# EAGLE design bluetooth_version (EAGLE 9.6.2)
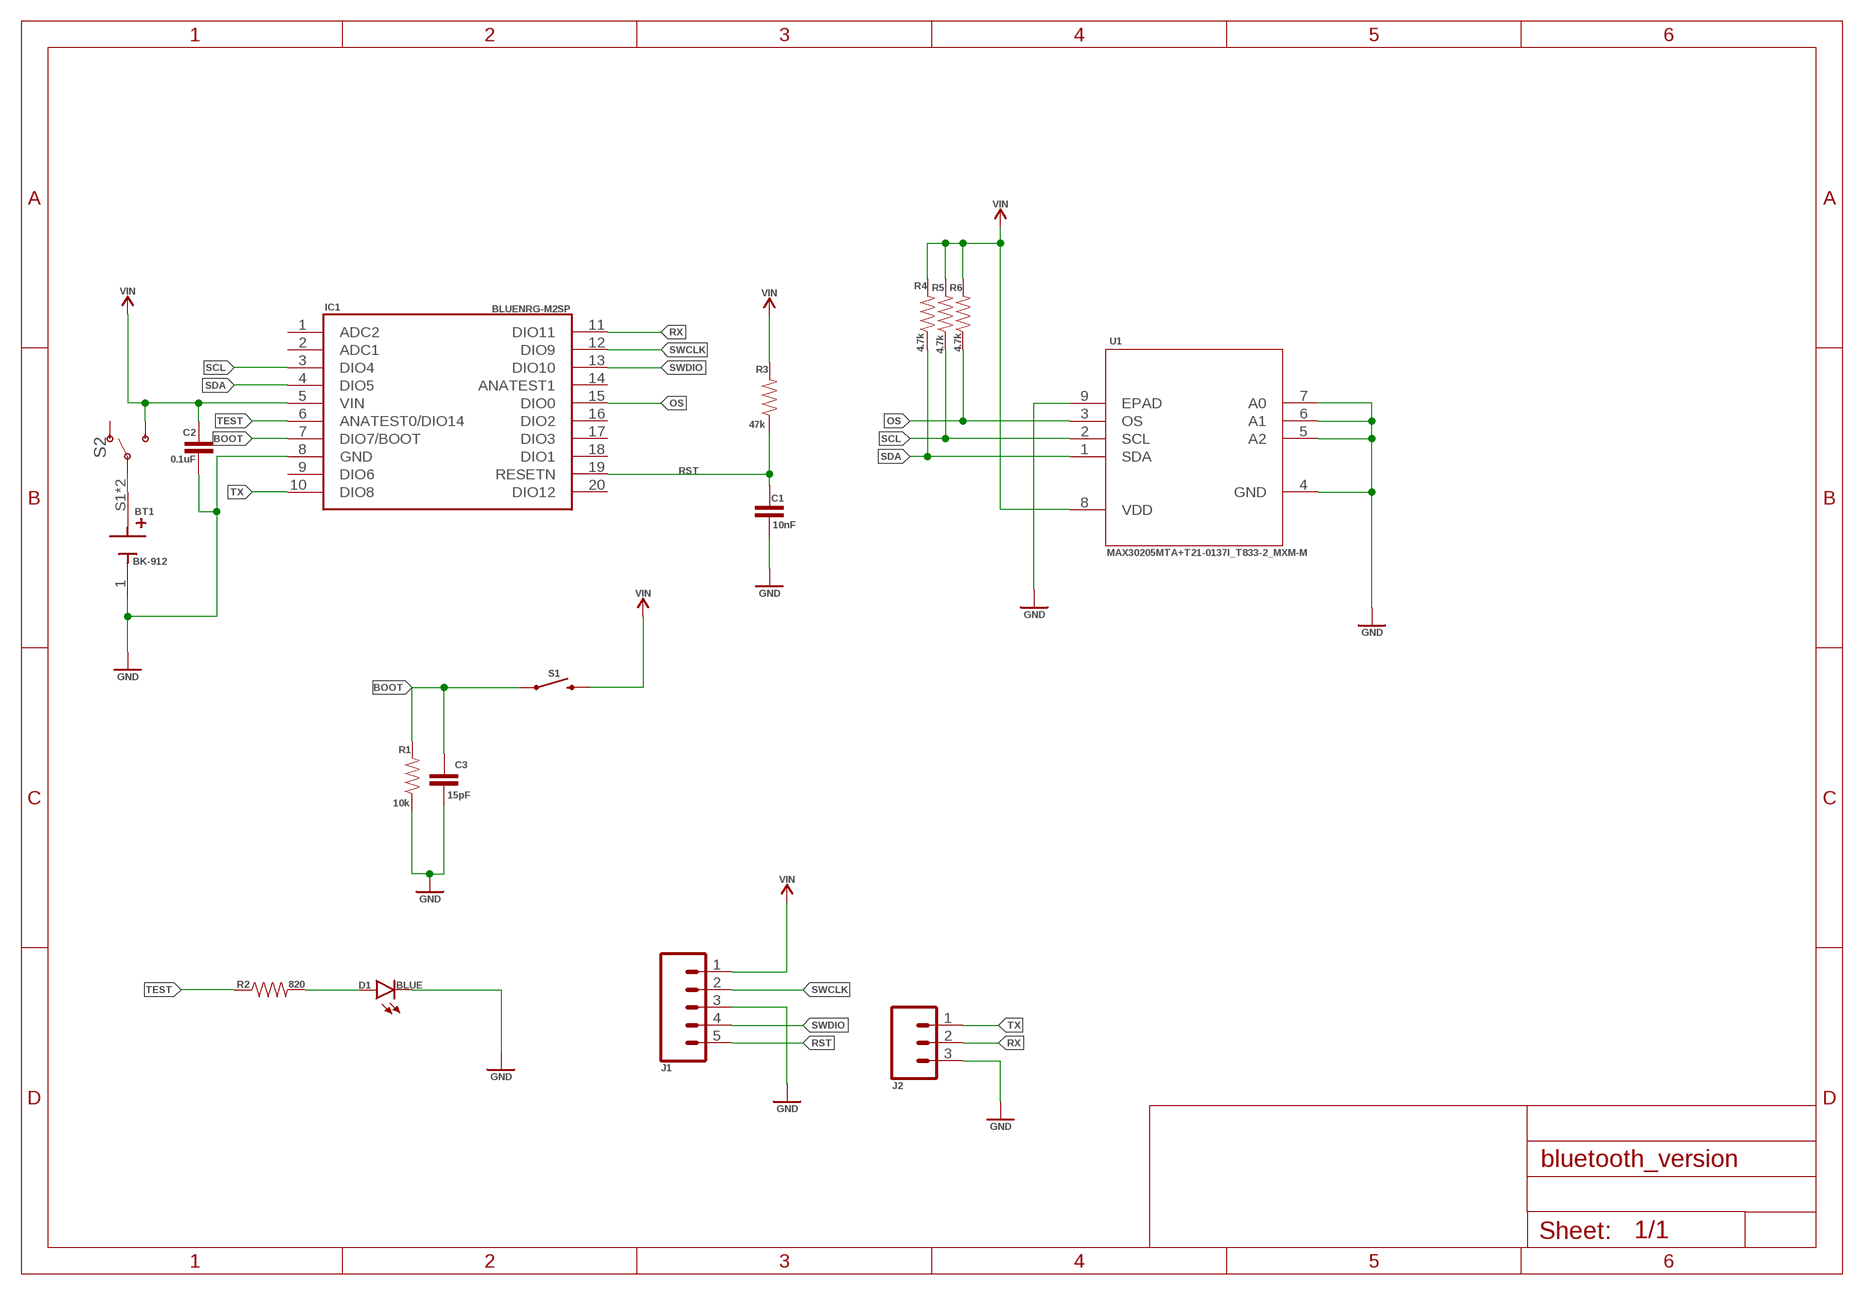
[diagram p0: schematic, sheet 1]

## Parts
BT1  BK-912  [BAT_BK-912]
C1  10nF  10NF-0603-50V-10%  [0603]
C2  0.1uF  0.1UF-0603-25V-(+80/-20%)  [0603]
C3  15pF  15PF-0603-50V-5%  [0603]
D1  BLUE  LED-BLUE0603  [LED-0603]
IC1  BLUENRG-M2SP  [BLUENRGM2SP]
J1  CONN_05  [1X05]
J2  455-1750-1-ND  CONN_03  [1X03]
R1  10k  10KOHM-0603-1/10W-1%  [0603]
R2  820  8.2KOHM-0603-1/10W-5%  [0603]
R3  47k  47KOHM-0603-1/10W-1%  [0603]
R4  4.7k  4.7KOHM-0603-1/10W-1%  [0603]
R5  4.7k  4.7KOHM-0603-1/10W-1%  [0603]
R6  4.7k  4.7KOHM-0603-1/10W-1%  [0603]
S1  MOMENTARY-SWITCH-SPST-SMD-4.6X2.8MM  [TACTILE_SWITCH_SMD_4.6X2.8MM]
S2  SWITCH-SPDT-SMD-RIGHT-ANGLE  [SWITCH_SPST_SMD_A]
U1  MAX30205MTA+T21-0137I_T833-2_MXM-M  [21-0137I_T833-2_MXM-M]

## Nets
BOOT: C3.1 IC1.7(DIO7/BOOT) R1.2 S1.1 S1.2
GND: BT1.1(-) C1.2 C2.2 C3.2 D1.C IC1.8(GND) J1.3 J2.3 R1.1 U1.4(GND) U1.5(A2) U1.6(A1) U1.7(A0) U1.9(EPAD)
N$1: D1.A R2.2
N$2: BT1.S1(+) BT1.S2(+) S2.2(P)
OS: IC1.15(DIO0) R6.1 U1.3(OS)
RST: C1.1 IC1.19(RESETN) J1.5 R3.1
RX: IC1.11(DIO11) J2.2
SCL: IC1.3(DIO4) R5.1 U1.2(SCL)
SDA: IC1.4(DIO5) R4.1 U1.1(SDA)
SWCLK: IC1.12(DIO9) J1.2
SWDIO: IC1.13(DIO10) J1.4
TEST: IC1.6(ANATEST0/DIO14) R2.1
TX: IC1.10(DIO8) J2.1
VIN: C2.1 IC1.5(VIN) J1.1 R3.2 R4.2 R5.2 R6.2 S1.3 S1.4 S2.3(S) U1.8(VDD)
Unconnected: IC1.1(ADC2) IC1.2(ADC1) IC1.9(DIO6) IC1.14(ANATEST1) IC1.16(DIO2) IC1.17(DIO3) IC1.18(DIO1) IC1.20(DIO12) S2.1(O)

## Library data of the parts
BT1 = BK-912:BK-912: BATTERY RETAINER COIN PC PIN Check prices <https://pricing.snapeda.com/search/part/BK-912/?ref=eda>; AVAILABILITY: Warning; DESCRIPTION: Battery Retainer Coin, 20.0mm 1 Cell SMD (SMT) Tab; MF: MPD (Memory; MP: BK-912; PACKAGE: DFN-12 Memory Protection Devices; PRICE: None; PURCHASE-URL: https://pricing.snapeda.com/search/part/BK-912/?ref=eda
C1 = SparkFun-Capacitors:10NF: 0.01uF/10nF/10,000pF ceramic capacitors A capacitor is a passive two-terminal electrical component used to store electrical energy temporarily in an electric field. CAP-09321; PROD_ID: CAP-00867
C2 = SparkFun-Capacitors:0.1UF: 0.1µF ceramic capacitors A capacitor is a passive two-terminal electrical component used to store electrical energy temporarily in an electric field.; PROD_ID: CAP-00810
C3 = SparkFun-Capacitors:15PF: 15pF ceramic capacitors A capacitor is a passive two-terminal electrical component used to store electrical energy temporarily in an electric field.; PROD_ID: CAP-07881
D1 = SparkFun-LED:LED-BLUE: Blue SMD LED Used in manufacturing of various products at SparkFun Packages: 0603 - SMD 0603 package [Product Link] <http://www.digikey.com/product-detail/en/SMLE12BC7TT86/511-1589-2-ND/1641808> 1206 - SMD1206 package [Product Link] <http://www.digikey.com/product-detail/en/lite-on-inc/LTST-C150TBKT/160-1643-1-ND/573584> SparkFun Products: ESP8266 Thing-Dev Board <https://www.sparkfun.com/products/13711> RedBoard <https://www.sparkfun.com/products/12757>; PROD_ID: DIO-08575
IC1 = SamacSys_Parts:BLUENRG-M2SP: STMicroelectronics Source: Datasheet <https://www.st.com/resource/en/datasheet/bluenrg-m2.pdf>; ARROW_PART_NUMBER: BLUENRG-M2SP; ARROW_PRICE-STOCK: https://www.arrow.com/en/products/bluenrg-m2sp/stmicroelectronics; DESCRIPTION: STMicroelectronics; HEIGHT: 2.5mm; MANUFACTURER_NAME: STMicroelectronics; MANUFACTURER_PART_NUMBER: BLUENRG-M2SP; MOUSER_PART_NUMBER: 511-BLUENRG-M2SP; MOUSER_PRICE-STOCK: https://www.mouser.co.uk/ProductDetail/STMicroelectronics/BLUENRG-M2SP?qs=%252B6g0mu59x7IAMQd6TX9bOA%3D%3D
J1 = SparkFun-Connectors:CONN_05: Multi connection point. Often used as Generic Header-pin footprint for 0.1 inch spaced/style header connections On any of the 0.1 inch spaced packages, you can populate with these: Break Away Headers - Straight <https://www.sparkfun.com/products/116> (PRT-00116) Break Away Male Headers - Right Angle <https://www.sparkfun.com/products/553> (PRT-00553) Female Headers <https://www.sparkfun.com/products/115> (PRT-00115) Break Away Headers - Machine Pin <https://www.sparkfun.com/products/117> (PRT-00117) Break Away Female Headers - Swiss Machine Pin <https://www.sparkfun.com/products/743> (PRT-00743) For SCREWTERMINALS and SPRING TERMINALS visit here: Screw Terimnals on SparkFun.com <https://www.sparkfun.com/search/results?term=Screw+Terminals> (5mm/3.5mm/2.54mm spacing) This device is also useful as a general connection point to wire up your design to another part of your project. Our various solder wires solder well into these plated through hole pads. Hook-Up Wire - Assortment (Stranded, 22 AWG) <https://www.sparkfun.com/products/11375> (PRT-11375) Hook-Up Wire - Assortment (Solid Core, 22 AWG) <https://www.sparkfun.com/products/11367> (PRT-11367) View the entire wire category on our website here <https://www.sparkfun.com/categories/141> Special notes: Molex polarized connector foot print use with SKU : PRT-08231 with associated crimp pins and housings. 1MM SMD Version SKU: PRT-10208
J2 = SparkFun-Connectors:CONN_03: Multi connection point. Often used as Generic Header-pin footprint for 0.1 inch spaced/style header connections On any of the 0.1 inch spaced packages, you can populate with these: Break Away Headers - Straight <https://www.sparkfun.com/products/116> (PRT-00116) Break Away Male Headers - Right Angle <https://www.sparkfun.com/products/553> (PRT-00553) Female Headers <https://www.sparkfun.com/products/115> (PRT-00115) Break Away Headers - Machine Pin <https://www.sparkfun.com/products/117> (PRT-00117) Break Away Female Headers - Swiss Machine Pin <https://www.sparkfun.com/products/743> (PRT-00743) Stackable Header - 3 Pin (Female, 0.1") <https://www.sparkfun.com/products/13875> (PRT-13875) For SCREWTERMINALS and SPRING TERMINALS visit here: Screw Terimnals on SparkFun.com <https://www.sparkfun.com/search/results?term=Screw+Terminals> (5mm/3.5mm/2.54mm spacing) This device is also useful as a general connection point to wire up your design to another part of your project. Our various solder wires solder well into these plated through hole pads. Hook-Up Wire - Assortment (Stranded, 22 AWG) <https://www.sparkfun.com/products/11375> (PRT-11375) Hook-Up Wire - Assortment (Solid Core, 22 AWG) <https://www.sparkfun.com/products/11367> (PRT-11367) View the entire wire category on our website here <https://www.sparkfun.com/categories/141> Special notes: Molex polarized connector foot print use with SKU : PRT-08232 with associated crimp pins and housings.; PROD_ID: XXX-00000
R1 = SparkFun-Resistors:10KOHM: 10kΩ resistor A resistor is a passive two-terminal electrical component that implements electrical resistance as a circuit element. Resistors act to reduce current flow, and, at the same time, act to lower voltage levels within circuits. - Wikipedia; PROD_ID: RES-00824
R2 = SparkFun-Resistors:8.2KOHM: 8.2kΩ resistor A resistor is a passive two-terminal electrical component that implements electrical resistance as a circuit element. Resistors act to reduce current flow, and, at the same time, act to lower voltage levels within circuits. - Wikipedia; PROD_ID: RES-10646; SPICEPREFIX: R; VALUE: 8.2k
R3 = SparkFun-Resistors:47KOHM: 47kΩ resistor A resistor is a passive two-terminal electrical component that implements electrical resistance as a circuit element. Resistors act to reduce current flow, and, at the same time, act to lower voltage levels within circuits. - Wikipedia; PROD_ID: RES-07871
R4-R6 = SparkFun-Resistors:4.7KOHM: 4.7kΩ resistor A resistor is a passive two-terminal electrical component that implements electrical resistance as a circuit element. Resistors act to reduce current flow, and, at the same time, act to lower voltage levels within circuits. - Wikipedia; PROD_ID: RES-07857
S1 = SparkFun-Switches:MOMENTARY-SWITCH-SPST: Momentary Switch (Pushbutton) - SPST Normally-open (NO) SPST momentary switches (buttons, pushbuttons). Variants PTH-12MM - 12mm square, through-hole Momentary Pushbutton Switch - 12mm Square <https://www.sparkfun.com/products/9190> (COM-09190) PTH-6.0MM, PTH-6.0MM-KIT - 6.0mm square, through-hole Mini Pushbutton Switch <https://www.sparkfun.com/products/97> (COM-00097) KIT package intended for soldering kit's - only one side of pads' copper is exposed. PTH-RIGHT-ANGLE-KIT - Right-angle, through-hole Right Angle Tactile Button <https://www.sparkfun.com/products/10791> - Used on SparkFun BigTime Watch Kit <https://www.sparkfun.com/products/11734> SMD-12MM - 12mm square, surface-mount Tactile Button - SMD (12mm) <https://www.sparkfun.com/products/12993> (COM-12993) Used on SparkFun PicoBoard <https://www.sparkfun.com/products/11888> SMD-4.5MM - 4.5mm Square Trackball Switch Used on SparkFun Blackberry Trackballer Breakout <https://www.sparkfun.com/products/13169> SMD-4.6MMX2.8MM - 4.60mm x 2.80mm, surface mount Used on SparkFun SAMD21 Mini Breakout <https://www.sparkfun.com/products/13664> SMD-5.2MM, SMD-5.2-REDUNDANT - 5.2mm square, surface-mount Mini Pushbutton Switch - SMD <https://www.sparkfun.com/products/8720> (COM-08720) Used on Arduino Pro Mini <https://www.sparkfun.com/products/11114> REDUNDANT package connects both switch circuits together SMD-6.0X3.5MM - 6.0 x 3.5mm, surface mount Momentary Reset Switch SMD <https://www.sparkfun.com/products/8229> (COM-08229) SMD-6.2MM-TALL - 6.2mm square, surface mount Tactile Button - SMD (6mm) <https://www.sparkfun.com/products/12992> Used on SparkFun Digital Sandbox <https://www.sparkfun.com/products/12651> SMD-RIGHT-ANGLE - Right-angle, surface mount Used on SparkFun Block for Intel® Edison - Arduino <https://www.sparkfun.com/products/13036>; PROD_ID: SWCH-13065
S2 = SparkFun-Switches:SWITCH-SPDT: Single Pole, Double Throw (SPDT) Switch Single-pole, double-throw (SPDT) switch. Variant Overview SMD-AYZ0202 Surface Mount DPDT Switch <https://www.sparkfun.com/products/597> (COM-00597) Used on e.g. LilyPad Arduino USB - ATmega32U4 Board <https://www.sparkfun.com/products/12049> PTH-11.6X4.0MM SPDT Mini Power Switch <https://www.sparkfun.com/products/102> (COM-00102) Used on e.g. SparkFun Simon Says - Through-Hole Soldering Kit <https://www.sparkfun.com/products/10547> (KIT-10547) PTH-11.6X4.0MM-KIT KIT version of SPDT Mini Power Switch - Simplifies soldering by removing tStop of switch pins - only one side can be soldered. PTH-11.6X4.0MM-LOCK LOCK version of SPDT Mini Power Switch - Offset pins hold switch in place for easier soldering. SMD-RIGHT-ANGLE Surface Mount Right Angle Switch <https://www.sparkfun.com/products/10860> (COM-10860) Used on e.g. SparkFun ESP8266 Thing <https://www.sparkfun.com/products/13231>; PROD_ID: SWCH-10651; SF_SKU: COM-10860
U1 = MAX30205:MAX30205MTA+T; BUILT_BY: EMA_UL_Team; COPYRIGHT: Copyright (C) 2018 Accelerated Designs. All rights reserved; MANUFACTURER_PART_NUMBER: MAX30205MTA+T; SOURCELIBRARY: Maxim_2018-11-30; VENDOR: Maxim Integrated Products

## Board
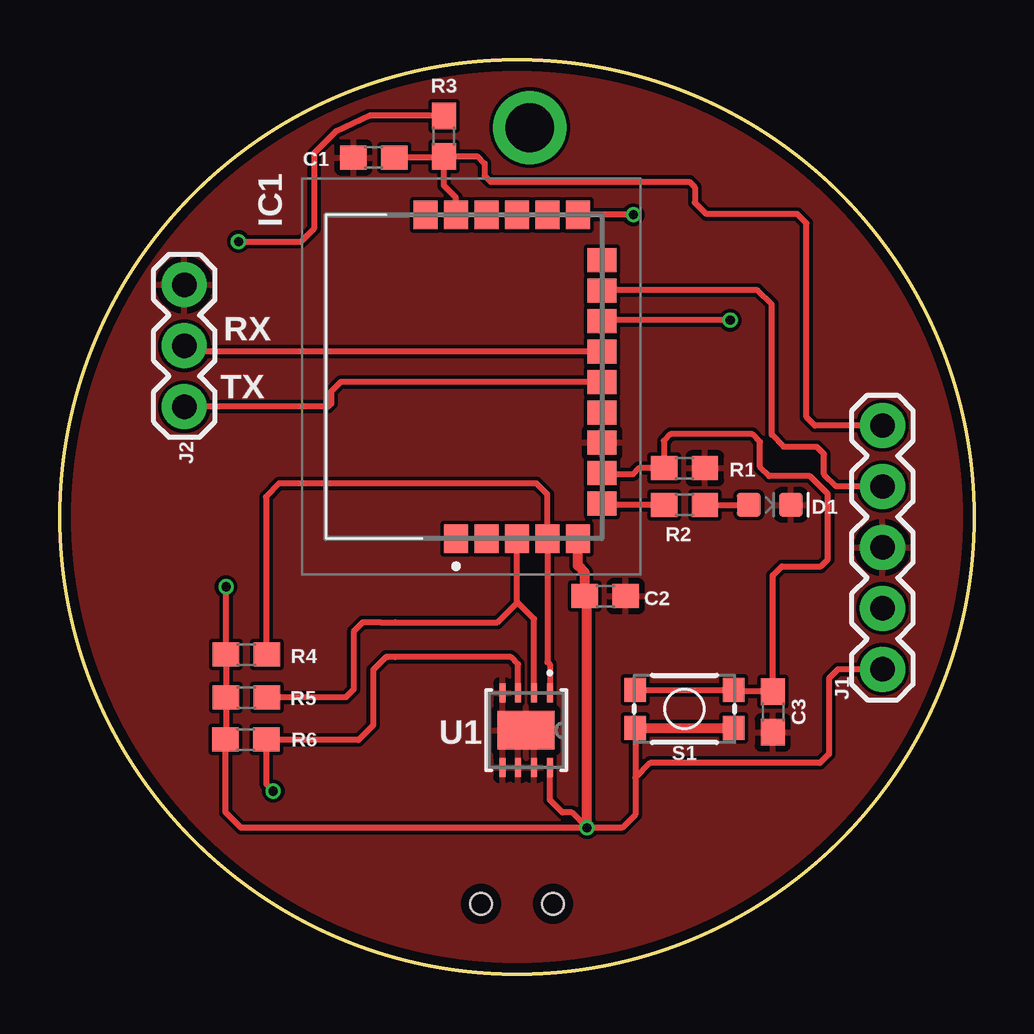
[diagram p1: board, top side]
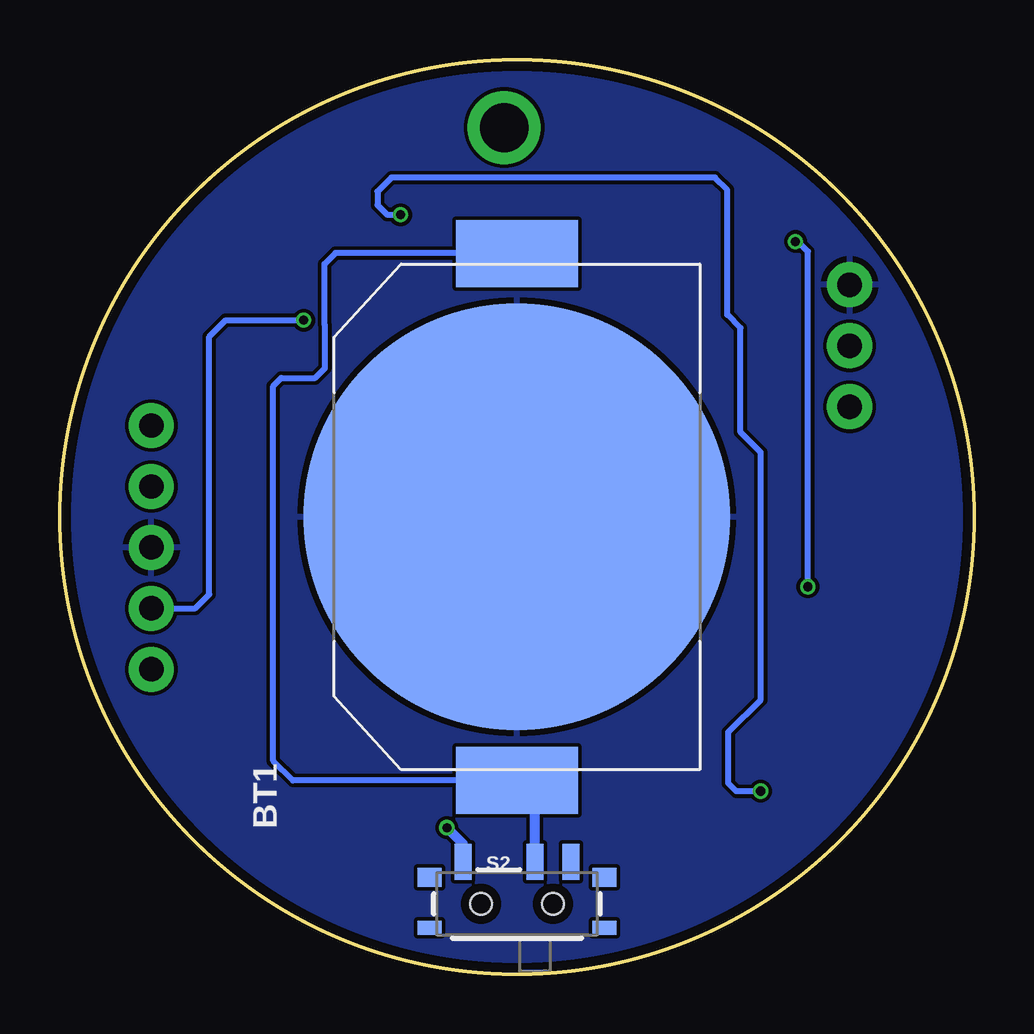
[diagram p2: board, bottom side, seen from below]

Size 38.1 x 38.1 mm. Coordinates in mm from the lower left corner, seen from the top.
Outline: circle at 19.05,19.05 radius 19.05
Copper layers (1*16): Top 0.035559375mm / dielectric 1.6mm / Bottom 0.035559375mm
Design rules "oshpark-2layer": minimum track width 6mil, minimum drill 10mil, track to track 6mil, track to pad 6mil, pad to pad 6mil, via to via 6mil, smd to smd 6mil, copper to edge 15mil, drill to drill 6mil, minimum pad ring 5mil, minimum via ring 5mil, stop-mask expansion 2.5mil, vias tented up to drill 0mil, thermal gap 10mil

### Footprints (pad centres in the part's own frame; a part is rotated, then mirrored left to right if it is on the bottom)
BAT_BK-912 = smd 17.78 x 17.78: 1 0,0 | smd 2.79 x 5.08: S1 -10.985,0; S2 10.985,0
0603 = smd 1.1 x 1: 1 -0.85,0; 2 0.85,0
LED-0603 = smd 1 x 1: A -0.877,0; C 0.877,0
BLUENRGM2SP = smd 1.2 x 1: 1 -6.75,1.27; 2 -6.75,0; 3 -6.75,-1.27; 4 -6.75,-2.54; 5 -6.75,-3.81; 15 6.75,-3.81; 16 6.75,-2.54; 17 6.75,-1.27; 18 6.75,0; 19 6.75,1.27; 20 6.75,2.54 | smd 1 x 1.2: 6 -5.29,-4.81; 7 -4.02,-4.81; 8 -2.75,-4.81; 9 -1.48,-4.81; 10 -0.21,-4.81; 11 1.06,-4.81; 12 2.33,-4.81; 13 3.6,-4.81; 14 4.87,-4.81
1X05 = drill 1.016 pad 1.88: 1 0,0; 2 2.54,0; 3 5.08,0; 4 7.62,0; 5 10.16,0
1X03 = drill 1.016 pad 1.88: 1 0,0; 2 2.54,0; 3 5.08,0
TACTILE_SWITCH_SMD_4.6X2.8MM = smd 0.9 x 1: 1 -2.05,-0.8; 2 2.05,-0.8; 3 2.05,0.8; 4 -2.05,0.8
SWITCH_SPST_SMD_A = smd 0.7 x 1.5: 1 -2.25,-1.75; 2 -0.75,-1.75; 3 2.25,-1.75 | smd 1 x 0.6: GND1 -3.65,1; GND3 3.65,1 | smd 1 x 0.8: GND2 -3.65,-1.1; GND4 3.65,-1.1 | hole 0.9: -1.5,0; 1.5,0
21-0137I_T833-2_MXM-M = smd 0.806 x 0.254: 1 -1.553,0.991; 2 -1.553,0.33; 3 -1.553,-0.33; 4 -1.553,-0.991; 5 1.553,-0.991; 6 1.553,-0.33; 7 1.553,0.33; 8 1.553,0.991 | smd 1.6 x 2.388: 9 0,0

### Placement (x,y rotation side)
BT1  19.05,19.05 90 bottom
C1  13.08,34.04 180 top
C2  22.73,15.75 0 top
C3  29.72,10.92 270 top
D1  29.59,19.56 0 top
IC1  17.78,24.89 90 top
J1  34.29,12.7 90 top
J2  5.18,23.65 90 top
R1  26.04,21.08 180 top
R2  26.04,19.56 0 top
R3  16,34.92 90 top
R4  7.77,13.31 180 top
R5  7.77,11.53 180 top
R6  7.75,9.78 180 top
S1  26.04,11.05 180 top
S2  19.05,2.92 180 bottom
U1  19.43,10.16 270 top

### Tracks (layer width: path | path; a pad name or v marks a point on that pad's centre or on a via)
BOOT
  Top 0.254: S1.2 28.07,11.85 | 28.07,11.85 S1.1 | 28.07,11.85 28.14,11.77 C3.1 29.72,16.61 30.1,16.99 31.73,16.99 32,17.27 32,20.02 31.27,20.75 29.57,20.75 29.19,21.13 29.19,22.17 28.85,22.5 25.45,22.5 25.17,22.23 25.17,21.1 R1.2 24.13,21.08 23.88,20.83 22.63,20.83 IC1.7
GND
  pour Top: -2.54,-2.54 -2.54,41.91 39.37,41.91 39.37,-2.54
  pour Bottom: -2.54,-2.54 -2.54,41.91 39.37,41.91 39.37,-2.54
N$1
  Top 0.254: R2.2 D1.A
N$2
  Bottom 0.254: BT1.S1 28.39,8.07 29.21,8.89 29.21,24.51 28.88,24.84 27.46,24.84 27.05,25.25 27.05,27.05 27.08,27.08 27.08,29.59 26.62,30.05 19.06,30.05 BT1.S2
  Bottom 0.406: S2.2 18.3,8.89 19.05,8.89 BT1.S1
N$3  (via drill 2.03)
  other vias: 19.58,35.28
OS  (via drill 0.38)
  Top 0.254: U1.3 19.1,12.9 18.8,13.21 13.97,13.21 13.67,13.21 13.59,13.21 13.06,12.68 13.06,10.36 12.45,9.75 8.62,9.75 R6.1 8.6,7.91 v8.89,7.62 | v23.9,31.65 v23.89,31.64 IC1.15
  Bottom 0.254: v8.89,7.62 9.91,7.62 10.24,7.95 10.24,10.08 8.89,11.43 8.89,21.74 9.73,22.58 9.73,26.92 10.29,27.48 10.29,32.69 10.79,33.2 24.28,33.2 24.87,32.61 24.87,32.05 24.46,31.65 v23.9,31.65
RST
  Top 0.254: IC1.19 16.51,32.36 16,32.87 R3.1 | R3.1 15.96,34.04 C1.1 | J1.5 31.47,22.86 31.12,23.22 31.12,31.29 30.73,31.67 26.95,31.67 26.47,32.16 26.47,32.79 26.24,33.02 17.96,33.02 17.7,33.27 17.7,33.78 17.4,34.09 16.01,34.09 R3.1
RX
  Top 0.254: IC1.11 5.42,25.95 J2.2
SCL
  Top 0.254: U1.2 19.76,14.81 19.07,15.49 | 19.07,15.49 19.05,15.52 IC1.3 | 19.07,15.49 18.24,14.66 13.97,14.66 13.36,14.66 12.62,14.66 12.24,14.28 12.24,11.86 11.91,11.53 R5.1
SDA
  Top 0.254: U1.1 20.42,12.9 20.32,13.01 IC1.4 20.32,19.99 19.86,20.45 9.14,20.45 8.59,19.89 8.59,13.35 R4.1
SWCLK  (via drill 0.38)
  Top 0.254: v27.94,27.25 22.62,27.25 IC1.12
  Bottom 0.254: J1.2 32.46,15.24 31.88,15.82 31.88,26.57 31.19,27.25 v27.94,27.25
SWDIO
  Top 0.254: J1.4 32.36,20.32 31.85,20.83 31.85,21.67 31.55,21.97 30.18,21.97 29.67,22.48 29.67,27.91 29.08,28.5 IC1.13
TEST
  Top 0.254: R2.1 22.63,19.56 IC1.6
TX
  Top 0.254: IC1.10 11.7,24.68 11.3,24.28 11.3,23.77 11.18,23.65 J2.1
VIN  (via drill 0.38)
  Top 0.254: v21.97,6.1 21.34,6.73 20.96,6.73 20.42,7.26 U1.8 | R4.2 R5.2 | R4.2 6.92,9.8 R6.2 6.9,6.74 7.54,6.1 v21.97,6.1 | S1.3 23.98,8.18 | 23.98,8.18 23.98,6.64 23.44,6.1 v21.97,6.1 | J1.1 32.44,12.7 32.05,12.32 32.05,9.17 31.67,8.79 24.59,8.79 23.98,8.18 | R4.2 v6.92,16.14 | R3.2 12.89,35.78 11.51,35.13 10.59,34.21 10.59,31.06 10.06,30.53 v7.44,30.53
  Top 0.406: v21.97,6.1 21.97,15.66 C2.1 21.88,16.73 21.59,17.02 IC1.5 | S1.3 S1.4
  Bottom 0.254: v6.92,16.14 6.92,30.11 7.34,30.53 v7.44,30.53
  Bottom 0.406: S2.3 21.3,5.43 v21.97,6.1

### Text on the board
tNames: RX | TX